# Altium schematic sheet motherboard_motor_drivers.SchDoc
size 840 x 594 mm; SheetNumber: 3; SheetTotal: 5
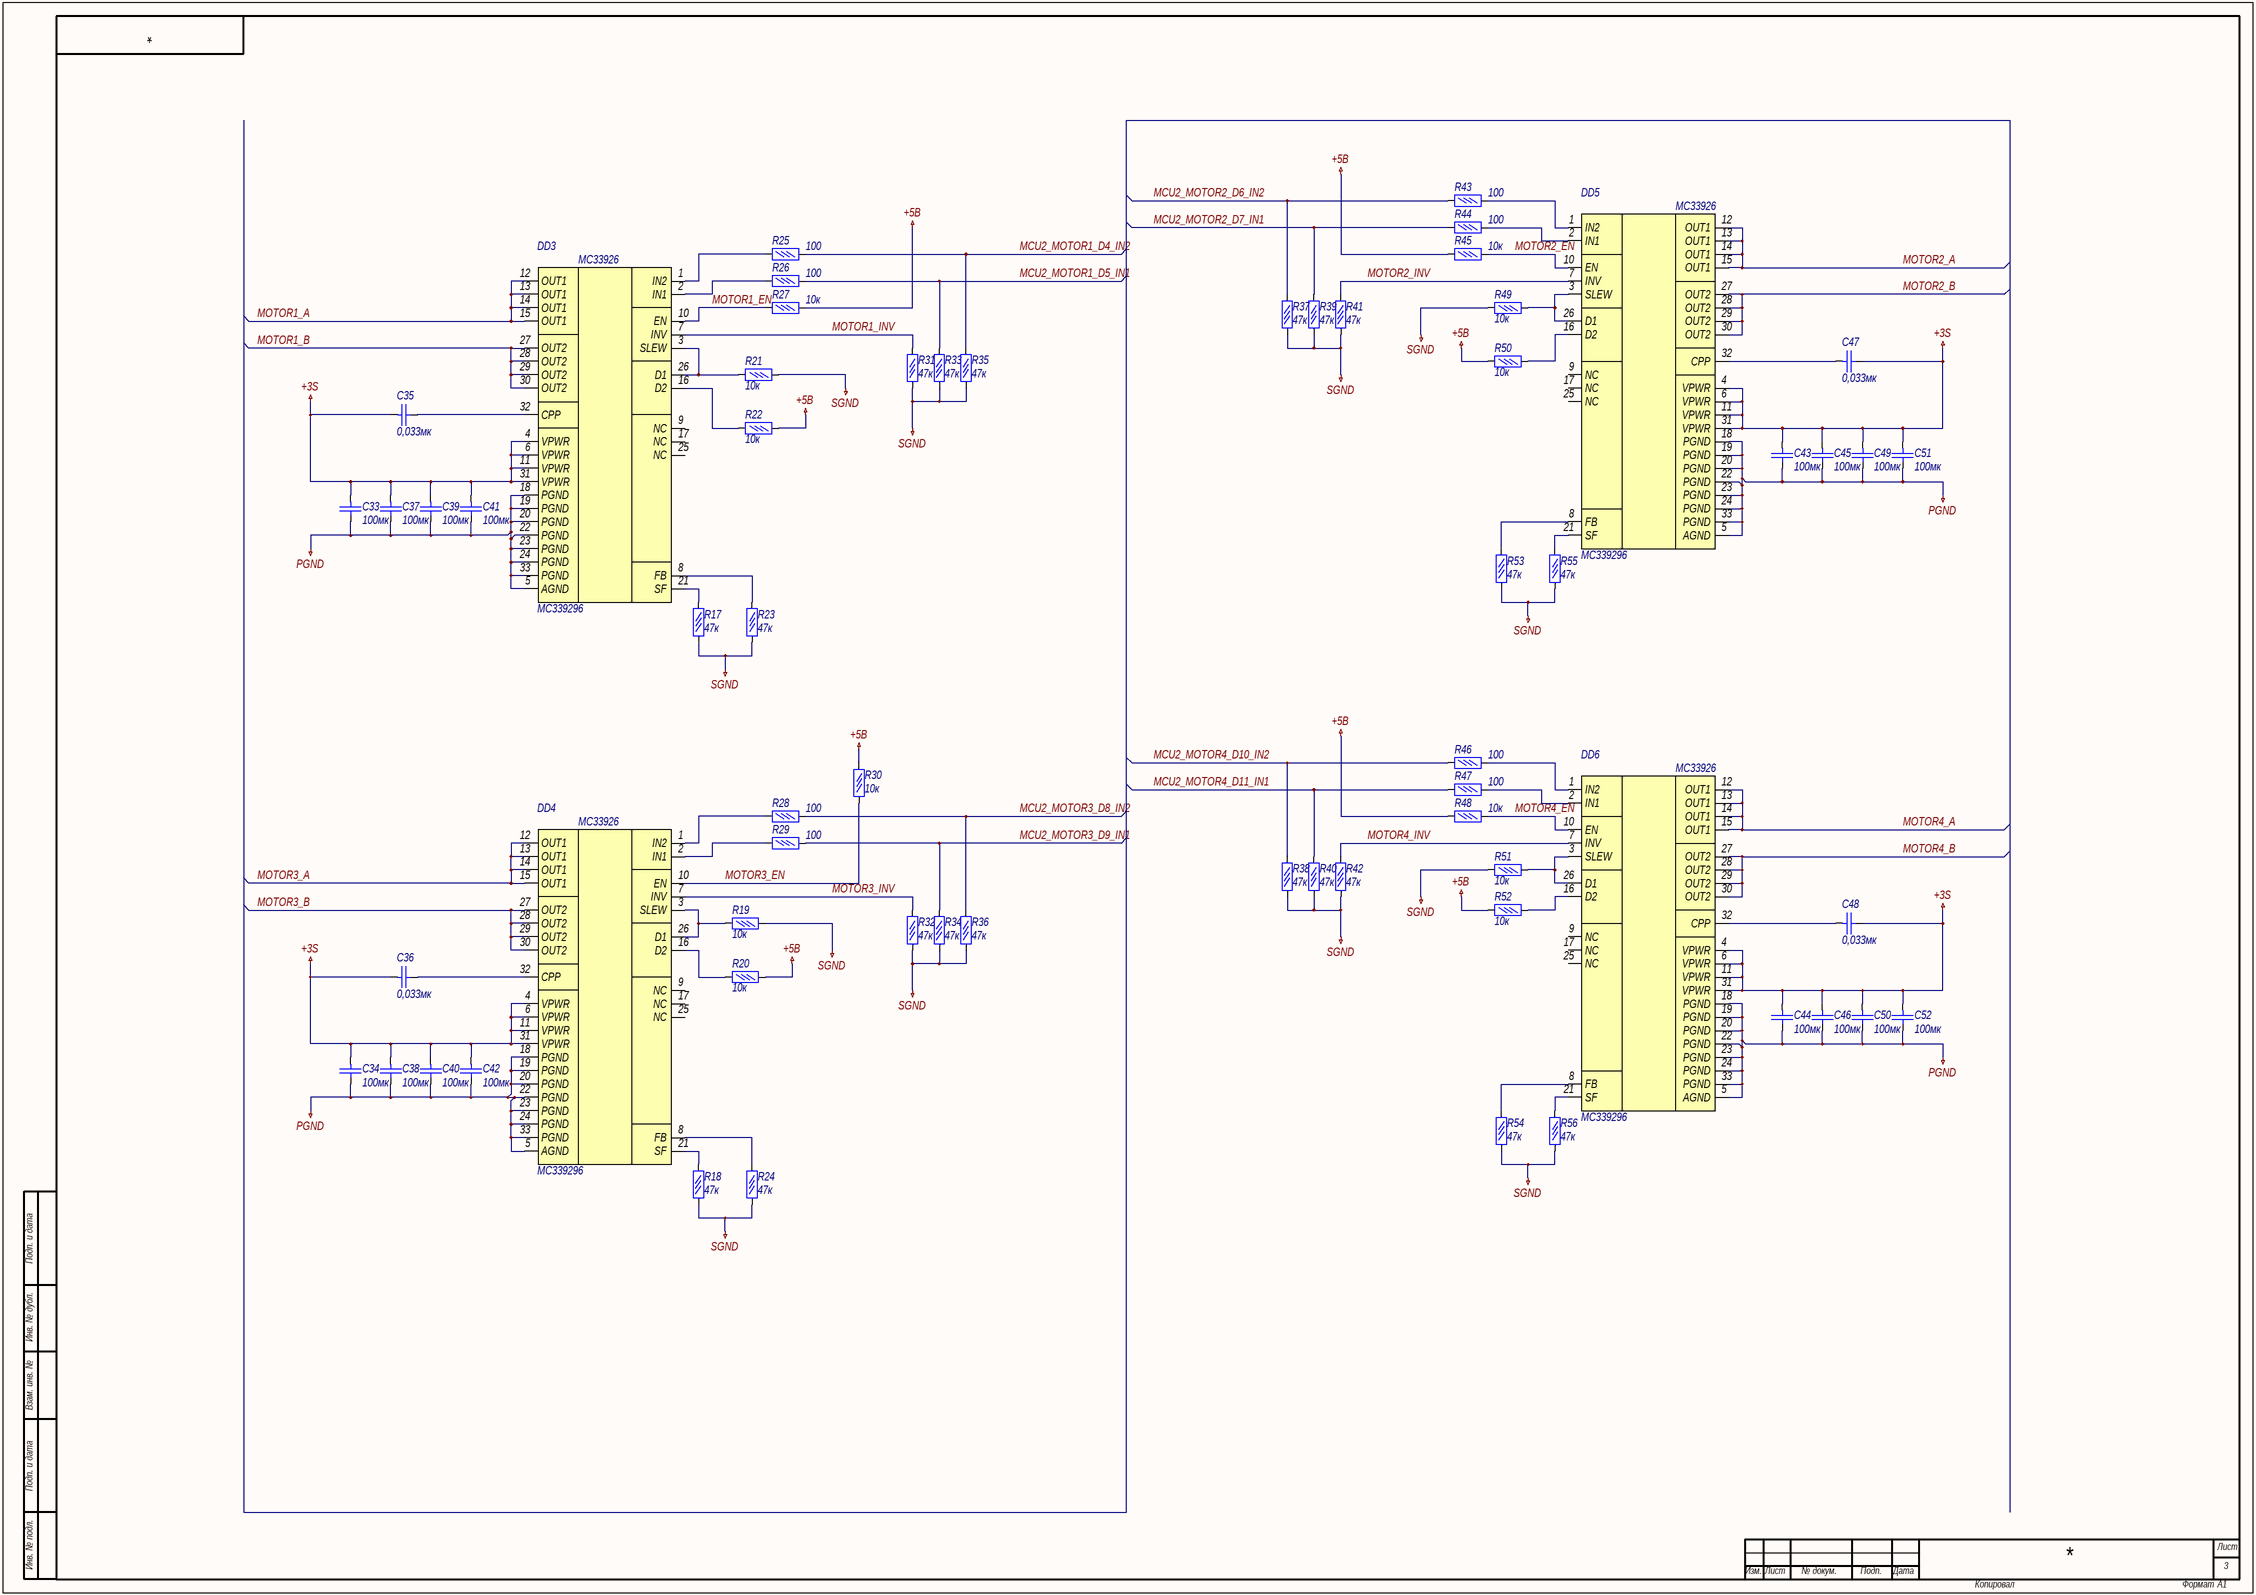
[diagram p0: motherboard_motor_drivers.SchDoc]

## Parts
DD3  MС339296  [PQFN32]
DD4  MС339296  [PQFN32]
DD5  MС339296  [PQFN32]
DD6  MС339296  [PQFN32]
R17  47к  [R0603]
R18  47к  [R0603]
R19  10к  [R0603]
R20  10к  [R0603]
R21  10к  [R0603]
R22  10к  [R0603]
R23  47к  [R0603]
R24  47к  [R0603]
R25  100  [R0603]
R26  100  [R0603]
R27  10к  [R0603]
R28  100  [R0603]
R29  100  [R0603]
R30  10к  [R0603]
R31  47к  [R0603]
R32  47к  [R0603]
R33  47к  [R0603]
R34  47к  [R0603]
R35  47к  [R0603]
R36  47к  [R0603]
R37  47к  [R0603]
R38  47к  [R0603]
R39  47к  [R0603]
R40  47к  [R0603]
R41  47к  [R0603]
R42  47к  [R0603]
R43  100  [R0603]
R44  100  [R0603]
R45  10к  [R0603]
R46  100  [R0603]
R47  100  [R0603]
R48  10к  [R0603]
R49  10к  [R0603]
R50  10к  [R0603]
R51  10к  [R0603]
R52  10к  [R0603]
R53  47к  [R0603]
R54  47к  [R0603]
R55  47к  [R0603]
R56  47к  [R0603]
С33  100мк  [C1210_AA - 2.5]
С34  100мк  [C1210_AA - 2.5]
С35  0,033мк  [C0603]
С36  0,033мк  [C0603]
С37  100мк  [C1210_AA - 2.5]
С38  100мк  [C1210_AA - 2.5]
С39  100мк  [C1210_AA - 2.5]
С40  100мк  [C1210_AA - 2.5]
С41  100мк  [C1210_AA - 2.5]
С42  100мк  [C1210_AA - 2.5]
С43  100мк  [C1210_AA - 2.5]
С44  100мк  [C1210_AA - 2.5]
С45  100мк  [C1210_AA - 2.5]
С46  100мк  [C1210_AA - 2.5]
С47  0,033мк  [C0603]
С48  0,033мк  [C0603]
С49  100мк  [C1210_AA - 2.5]
С50  100мк  [C1210_AA - 2.5]
С51  100мк  [C1210_AA - 2.5]
С52  100мк  [C1210_AA - 2.5]

## Nets
+3S: DD3.4(VPWR) DD3.6(VPWR) DD3.11(VPWR) DD3.31(VPWR) DD4.4(VPWR) DD4.6(VPWR) DD4.11(VPWR) DD4.31(VPWR) DD5.4(VPWR) DD5.6(VPWR) DD5.11(VPWR) DD5.31(VPWR) DD6.4(VPWR) DD6.6(VPWR) DD6.11(VPWR) DD6.31(VPWR) С33.2 С34.2 С35.2 С36.2 С37.2 С38.2 С39.2 С40.2 С41.2 С42.2 С43.2 С44.2 С45.2 С46.2 С47.1 С48.1 С49.2 С50.2 С51.2 С52.2
+5В: R20.1 R22.1 R27.2 R30.2 R45.1 R48.1 R50.2 R52.2
PGND: DD3.5(AGND) DD3.18(PGND) DD3.19(PGND) DD3.20(PGND) DD3.22(PGND) DD3.23(PGND) DD3.24(PGND) DD3.33(PGND) DD4.5(AGND) DD4.18(PGND) DD4.19(PGND) DD4.20(PGND) DD4.22(PGND) DD4.23(PGND) DD4.24(PGND) DD4.33(PGND) DD5.5(AGND) DD5.18(PGND) DD5.19(PGND) DD5.20(PGND) DD5.22(PGND) DD5.23(PGND) DD5.24(PGND) DD5.33(PGND) DD6.5(AGND) DD6.18(PGND) DD6.19(PGND) DD6.20(PGND) DD6.22(PGND) DD6.23(PGND) DD6.24(PGND) DD6.33(PGND) С33.1 С34.1 С37.1 С38.1 С39.1 С40.1 С41.1 С42.1 С43.1 С44.1 С45.1 С46.1 С49.1 С50.1 С51.1 С52.1
SGND: R17.1 R18.2 R19.1 R21.1 R23.1 R24.2 R31.2 R32.2 R33.2 R34.2 R35.2 R36.2 R37.2 R38.2 R39.2 R40.2 R41.2 R42.2 R49.2 R51.2 R53.1 R54.1 R55.1 R56.1
MCU2_MOTOR1_D4_IN2: R25.2 R35.1
MCU2_MOTOR1_D5_IN1: R26.2 R33.1
MCU2_MOTOR2_D6_IN2: R37.1 R43.1
MCU2_MOTOR2_D7_IN1: R39.1 R44.1
MCU2_MOTOR3_D8_IN2: R28.2 R36.1
MCU2_MOTOR3_D9_IN1: R29.2 R34.1
MCU2_MOTOR4_D10_IN2: R38.1 R46.1
MCU2_MOTOR4_D11_IN1: R40.1 R47.1
MOTOR1_A: DD3.12(OUT1) DD3.13(OUT1) DD3.14(OUT1) DD3.15(OUT1)
MOTOR1_B: DD3.27(OUT2) DD3.28(OUT2) DD3.29(OUT2) DD3.30(OUT2)
MOTOR1_EN: DD3.10(EN) R27.1
MOTOR1_INV: DD3.7(INV) R31.1
MOTOR2_A: DD5.12(OUT1) DD5.13(OUT1) DD5.14(OUT1) DD5.15(OUT1)
MOTOR2_B: DD5.27(OUT2) DD5.28(OUT2) DD5.29(OUT2) DD5.30(OUT2)
MOTOR2_EN: DD5.10(EN) R45.2
MOTOR2_INV: DD5.7(INV) R41.1
MOTOR3_A: DD4.12(OUT1) DD4.13(OUT1) DD4.14(OUT1) DD4.15(OUT1)
MOTOR3_B: DD4.27(OUT2) DD4.28(OUT2) DD4.29(OUT2) DD4.30(OUT2)
MOTOR3_EN: DD4.10(EN) R30.1
MOTOR3_INV: DD4.7(INV) R32.1
MOTOR4_A: DD6.12(OUT1) DD6.13(OUT1) DD6.14(OUT1) DD6.15(OUT1)
MOTOR4_B: DD6.27(OUT2) DD6.28(OUT2) DD6.29(OUT2) DD6.30(OUT2)
MOTOR4_EN: DD6.10(EN) R48.2
MOTOR4_INV: DD6.7(INV) R42.1
NetDD3_1: DD3.1(IN2) R25.1
NetDD3_2: DD3.2(IN1) R26.1
NetDD3_3: DD3.3(SLEW) DD3.26(D1) R21.2
NetDD3_8: DD3.8(FB) R23.2
NetDD3_16: DD3.16(D2) R22.2
NetDD3_21: DD3.21(SF) R17.2
NetDD3_32: DD3.32(CPP) С35.1
NetDD4_1: DD4.1(IN2) R28.1
NetDD4_2: DD4.2(IN1) R29.1
NetDD4_3: DD4.3(SLEW) DD4.26(D1) R19.2
NetDD4_8: DD4.8(FB) R24.1
NetDD4_16: DD4.16(D2) R20.2
NetDD4_21: DD4.21(SF) R18.1
NetDD4_32: DD4.32(CPP) С36.1
NetDD5_1: DD5.1(IN2) R43.2
NetDD5_2: DD5.2(IN1) R44.2
NetDD5_3: DD5.3(SLEW) DD5.26(D1) R49.1
NetDD5_8: DD5.8(FB) R53.2
NetDD5_16: DD5.16(D2) R50.1
NetDD5_21: DD5.21(SF) R55.2
NetDD5_32: DD5.32(CPP) С47.2
NetDD6_1: DD6.1(IN2) R46.2
NetDD6_2: DD6.2(IN1) R47.2
NetDD6_3: DD6.3(SLEW) DD6.26(D1) R51.1
NetDD6_8: DD6.8(FB) R54.2
NetDD6_16: DD6.16(D2) R52.1
NetDD6_21: DD6.21(SF) R56.2
NetDD6_32: DD6.32(CPP) С48.2

Not connected (* = marked no-connect by the designer): DD3 9(NC) 17(NC) 25(NC); DD4 9(NC) 17(NC) 25(NC); DD5 9(NC) 17(NC) 25(NC); DD6 9(NC) 17(NC) 25(NC)

## Notes on the sheet
- Подп. и дата
- Инв. № дубл.
- Взам. инв. №
- Инв. № подл.
- Лист
- Изм.
- № докум.
- Подп.
- Дата
- Копировал
- Формат
- А1
- (in symbol MС339296) MC33926

## Library data of the parts
R17-R56 = Резистор 0.05Вт: Резистор 0,05Вт
  R17 R18 R23 R24 R31-R42 R53-R56: Value: 47к
  R19-R22 R27 R30 R45 R48-R52: Value: 10к
  R25 R26 R28 R29 R43 R44 R46 R47: Value: 100
С33-С52 = Кер. конденсатор
  С33 С34 С37-С46 С49-С52: Value: 100мк
  С35 С36 С47 С48: Value: 0,033мк
DD3-DD6 = MС339296: Name: MС339296